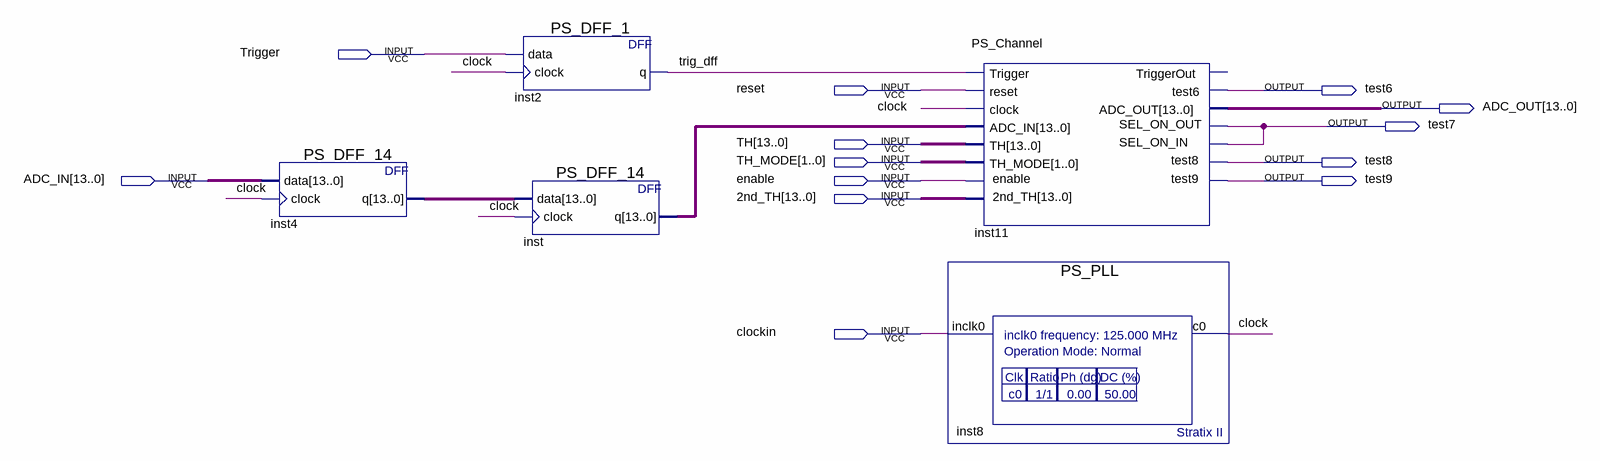
[diagram p0: schematic sheet]
// Quartus schematic PS.bdf as structural Verilog: 5 symbols, 13 pins
module PS (
  input  Trigger,
  input  reset,
  input  [13:0] TH,
  input  [1:0] TH_MODE,
  input  [13:0] ADC_IN,
  input  enable,
  input  [13:0] \2nd_TH ,
  input  clockin,
  output test6,
  output [13:0] ADC_OUT,
  output test7,
  output test8,
  output test9
);

  wire clock, trig_dff;
  wire [13:0] inst4_q, inst_q;

  PS_DFF_14 inst4 (.data(ADC_IN), .clock(clock), .q(inst4_q));
  PS_DFF_1 inst2 (.data(Trigger), .clock(clock), .q(trig_dff));
  PS_DFF_14 inst (.data(inst4_q), .clock(clock), .q(inst_q));
  PS_Channel inst11 (
    .Trigger(trig_dff), .reset(reset), .clock(clock), .ADC_IN(inst_q), .TH(TH), .TH_MODE(TH_MODE),
    .enable(enable), .\2nd_TH (\2nd_TH ), .SEL_ON_IN(test7), .test6(test6), .ADC_OUT(ADC_OUT), .test8(test8),
    .test9(test9), .SEL_ON_OUT(test7));  // open: TriggerOut
  PS_PLL inst8 (.inclk0(clockin), .c0(clock));
endmodule
